# Altium project Gate_Level_Modeling.PrjPcb
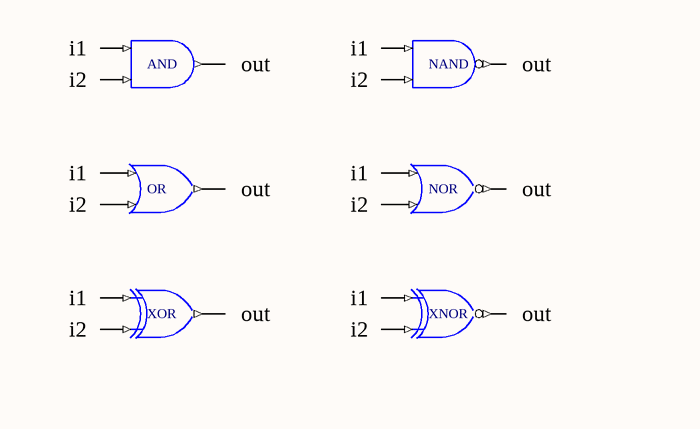
[diagram p0: 05_01_Basic_Gates.SchDoc]
8 sheets, 29 parts. Net scope: hierarchical (ports join the sheet entries above them; power ports are global).
Sheets:
  05_01_Basic_Gates.SchDoc
  05_02_Truth_Tables.SchDoc
  05_03_Buf_and_Not_Gates.SchDoc
  05_04_Bufif_and_Notif.SchDoc
  05_06_mux_gate.SchDoc
  05_05_mux_schem.SchDoc
  05_07_1bit_Full_Adder.SchDoc
  05_08_4bit_Ripple_Carry_Full_Adder.SchDoc

## Sheet 05_01_Basic_Gates.SchDoc
size 111 x 66 mm

### Parts
U9  AND
U10  NAND
U11  OR
U12  NOR
U13  XOR
U14  XNOR

### Nets
GND: U13.7(GND)
VDD: U13.14(VDD)

Not connected (* = marked no-connect by the designer): U9 A B Y; U10 A B Y; U11 A B Y; U12 A B Y; U13 1(A) 2(B) 3(Y); U14 1(A) 2(B) 3(Y)

### Notes on the sheet
- (near U9) i1
- (near U9) out
- (near U10) i1
- (near U10) out
- (near U9) i2
- (near U10) i2
- (near U11) i1
- (near U11) i2
- (near U11) out
- (near U12) i1
- (near U12) i2
- (near U12) out
- (near U13) i1
- (near U14) i1
- (near U13) i2
- (near U13) out
- (near U14) i2
- (near U14) out

### Library data of the parts
U9 U10 = AND: 2 Input AND
U11 U12 = OR: 2 Input OR
U14 = XOR

## Sheet 05_02_Truth_Tables.SchDoc
size 111 x 66 mm
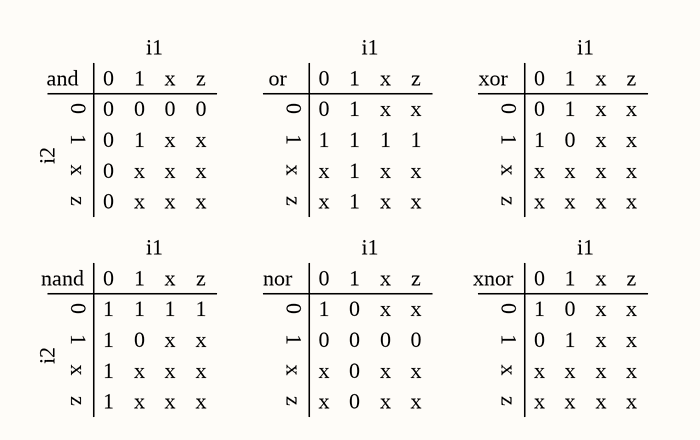
[diagram p1: 05_02_Truth_Tables.SchDoc]

### Notes on the sheet
- and
- 0
- 1
- i1
- x
- z
- or
- xor
- i2
- nand
- nor
- xnor

## Sheet 05_03_Buf_and_Not_Gates.SchDoc
size 111 x 66 mm
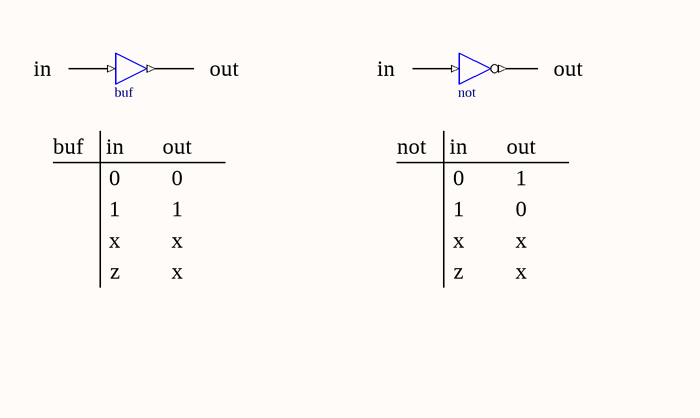
[diagram p2: 05_03_Buf_and_Not_Gates.SchDoc]

### Parts
U15  buf
U16  not

### Nets

Not connected (* = marked no-connect by the designer): U15 I O; U16 I O

### Notes on the sheet
- in
- out
- buf
- 0
- 1
- not
- x
- z

### Library data of the parts
U15 U16 = BUF: 1-bit General Purpose (Non-inverting) Buffer

## Sheet 05_04_Bufif_and_Notif.SchDoc
size 142 x 66 mm
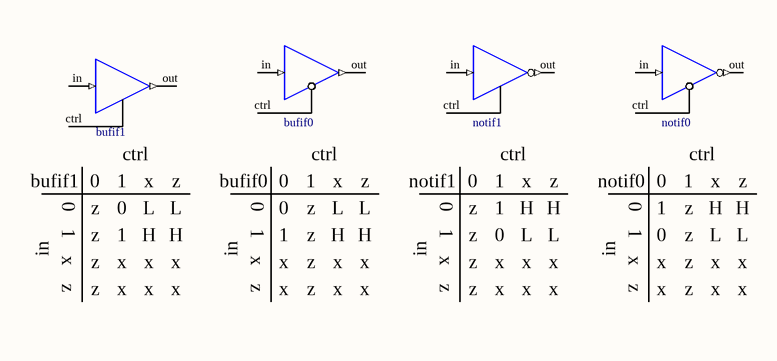
[diagram p3: 05_04_Bufif_and_Notif.SchDoc]

### Parts
U17  bufif0
U18  notif1
U19  notif0
U20  bufif1

### Nets

Not connected (* = marked no-connect by the designer): U17 ctrl in out; U18 ctrl in out; U19 ctrl in out; U20 ctrl in out

### Notes on the sheet
- (near U20) bufif1
- (near U20) 0
- (near U20) 1
- (near U20) ctrl
- (near U20) x
- (near U20) z
- bufif0
- 0
- 1
- (near U17) ctrl
- x
- z
- notif1
- (near U18) ctrl
- notif0
- (near U19) ctrl
- in
- L
- H

## Sheet 05_06_mux_gate.SchDoc
size 101 x 81 mm
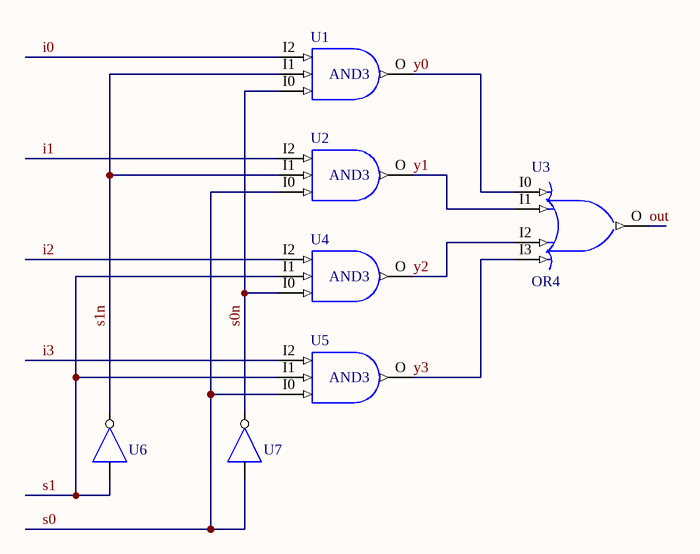
[diagram p4: 05_06_mux_gate.SchDoc]

### Parts
(Parts that share a designator on the sheet are numbered #1, #2 ... from top to bottom, then left to right.)
U1#1  AND3
U2#1  AND3
U3#1  OR4
U4#1  AND3
U5#1  AND3
U6  not  (value not drawn)
U7  not  (value not drawn)

### Nets
i0: U1#1.I2
i1: U2#1.I2
i2: U4#1.I2
i3: U5#1.I2
out: U3#1.O
s0: U2#1.I0 U5#1.I0 U7.i
s0n: U1#1.I0 U4#1.I0 U7.o
s1: U4#1.I1 U5#1.I1 U6.i
s1n: U1#1.I1 U2#1.I1 U6.o
y0: U1#1.O U3#1.I0
y1: U2#1.O U3#1.I1
y2: U3#1.I2 U4#1.O
y3: U3#1.I3 U5#1.O

### Library data of the parts
U1#1 U2#1 U4#1 U5#1 = AND3: 3-Input AND Gate; FPGAVendor: CUPL; Published: 17/04/2002 5:24:18 PM; DatasheetDocument: 1999; Publisher: Altium Limited
U3#1 = OR4: 4-Input OR Gate; FPGAVendor: CUPL; Published: 17-Apr-2002; Publisher: Altium Limited
U6 U7 = BUF: as U15 on sheet 05_03_Buf_and_Not_Gates

## Sheet 05_05_mux_schem.SchDoc
size 101 x 81 mm
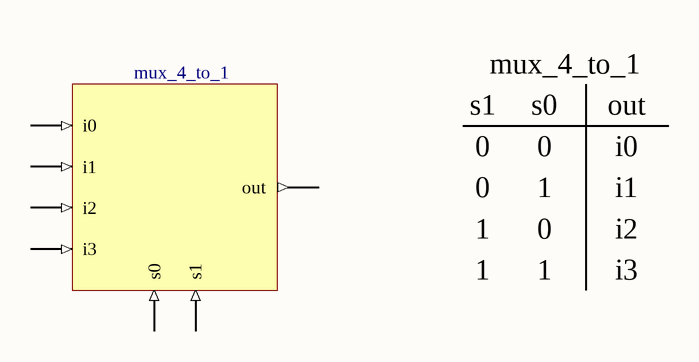
[diagram p5: 05_05_mux_schem.SchDoc]

### Parts
U8  mux_4_to_1

### Nets

Not connected (* = marked no-connect by the designer): U8 i0 i1 i2 i3 out s0 s1

### Notes on the sheet
- mux_4_to_1
- s1
- 0
- s0
- out
- i0
- 1
- i1
- i2
- i3

## Sheet 05_07_1bit_Full_Adder.SchDoc
size A4
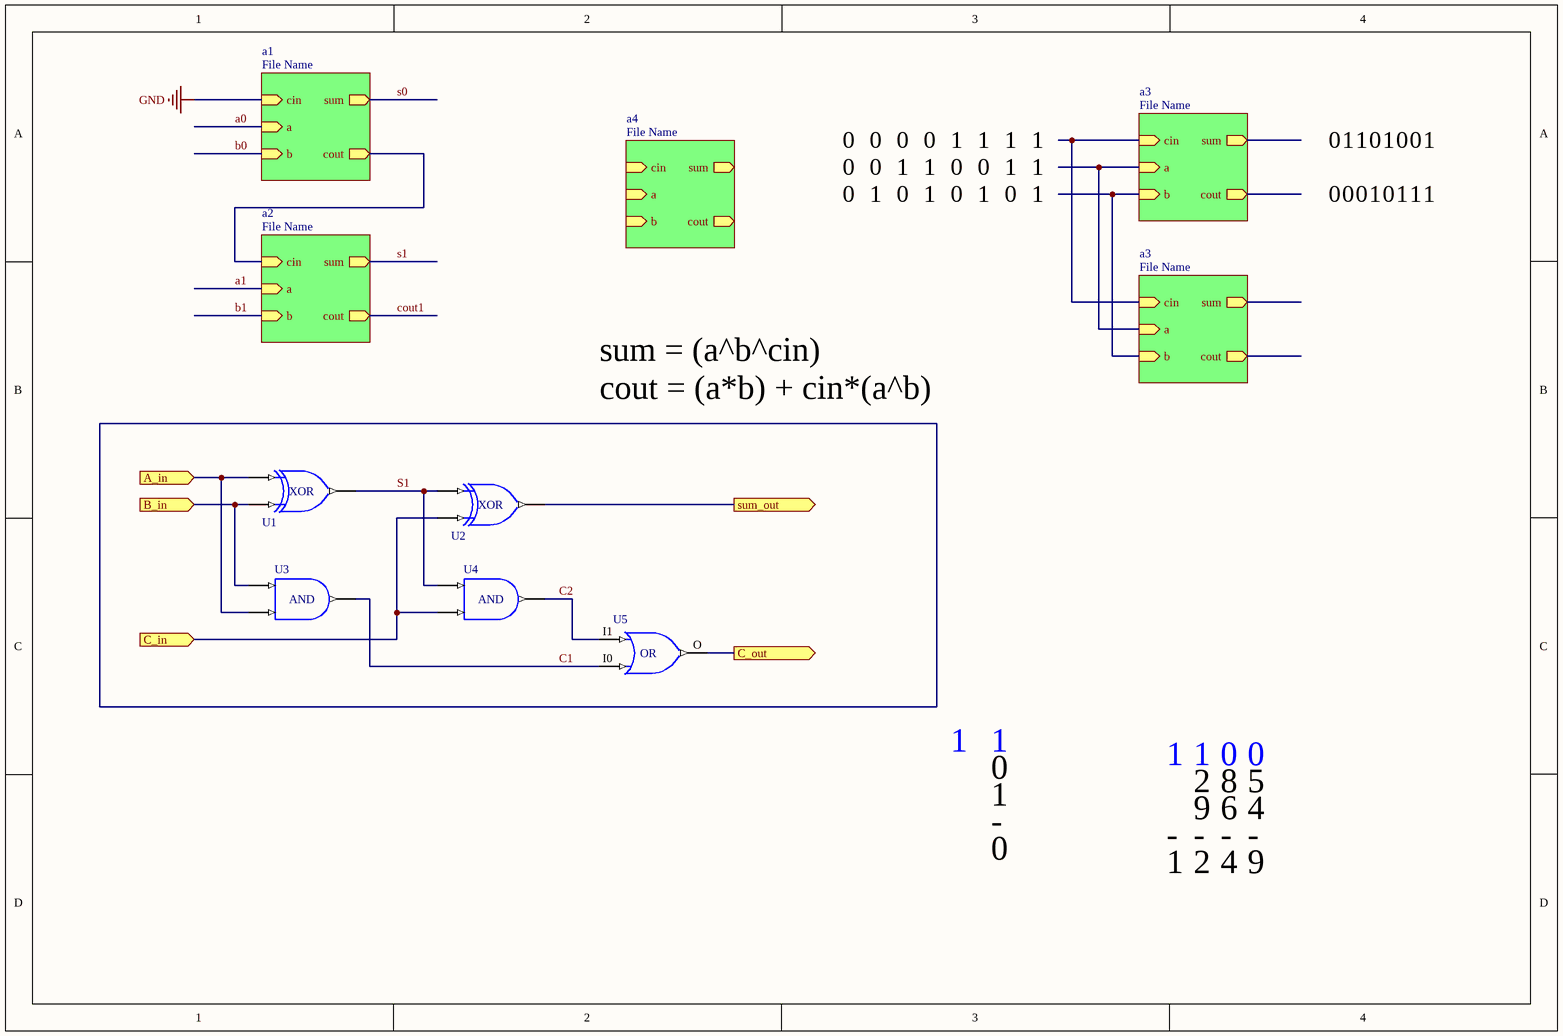
[diagram p6: 05_07_1bit_Full_Adder.SchDoc]

### Parts
(Parts that share a designator on the sheet are numbered #1, #2 ... from top to bottom, then left to right.)
U1#2  XOR
U2#2  XOR
U3#2  AND
U4#2  AND
U5#2  OR

### Sub-sheets
a1 = File Name (file not in this document): a (in), b (in), cin (in), sum (out), cout (out)
a2 = File Name (file not in this document): a (in), b (in), cin (in), sum (out), cout (out)
a3 = File Name (file not in this document): a (in), b (in), cin (in), sum (out), cout (out)
a3 = File Name (file not in this document): a (in), b (in), cin (in), sum (out), cout (out)
a4 = File Name (file not in this document): a (in), b (in), cin (in), sum (out), cout (out)

### Ports
A_in (in), B_in (in), C_in (in), C_out (out), sum_out (out)

### Nets
GND: U1#2.7(GND) U2#2.7(GND) ; sheet a1/cin
VDD: U1#2.14(VDD) U2#2.14(VDD)
a0: sheet a1/a
a1: sheet a2/a
b0: sheet a1/b
b1: sheet a2/b
C1: U3#2.Y U5#2.I0
C2: U4#2.Y U5#2.I1
cout1: sheet a2/cout
s0: sheet a1/sum
S1: U1#2.3(Y) U2#2.1(A) U4#2.A ; sheet a2/sum
NetU1#2_1: U1#2.1(A) U3#2.B ; port A_in
NetU1#2_2: U1#2.2(B) U3#2.A ; port B_in
NetU2#2_2: U2#2.2(B) U4#2.B ; port C_in
NetU2#2_3: U2#2.3(Y) ; port sum_out
NetU5#2_O: U5#2.O ; port C_out
(unnamed): sheet a1/cout, sheet a2/cin
(unnamed): sheet a3/a, sheet a3/a
(unnamed): sheet a3/b, sheet a3/b
(unnamed): sheet a3/cin, sheet a3/cin

### Notes on the sheet
- 0
- 1
- sum = (a^b^cin)
  cout = (a*b) + cin*(a^b)
- -
- 2
- 9
- 8
- 6
- 5
- 4

### Library data of the parts
U3#2 U4#2 = AND: 2 Input AND
U5#2 = OR2: 2-Input OR Gate; FPGAVendor: CUPL; Published: 17-Apr-2002; Publisher: Altium Limited

## Sheet 05_08_4bit_Ripple_Carry_Full_Adder.SchDoc
size 81 x 101 mm
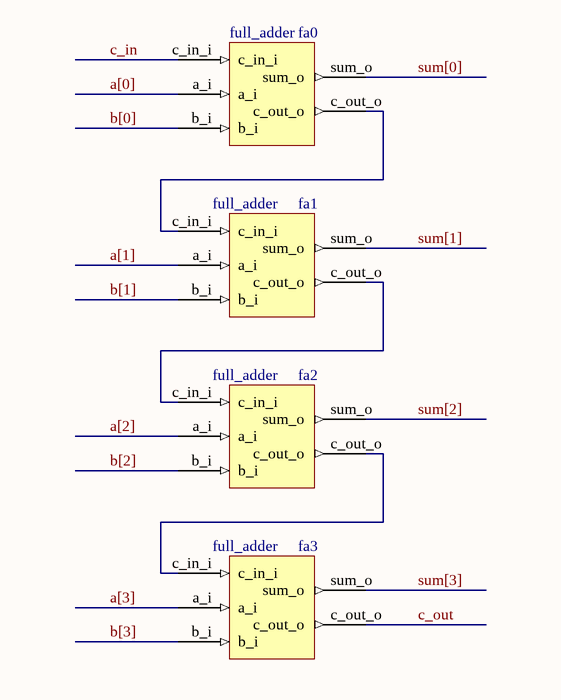
[diagram p7: 05_08_4bit_Ripple_Carry_Full_Adder.SchDoc]

### Parts
fa0  full_adder
fa1  full_adder
fa2  full_adder
fa3  full_adder

### Nets
a[0]: fa0.a_i
a[1]: fa1.a_i
a[2]: fa2.a_i
a[3]: fa3.a_i
b[0]: fa0.b_i
b[1]: fa1.b_i
b[2]: fa2.b_i
b[3]: fa3.b_i
c_in: fa0.c_in_i
c_out: fa3.c_out_o
sum[0]: fa0.sum_o
sum[1]: fa1.sum_o
sum[2]: fa2.sum_o
sum[3]: fa3.sum_o
Netfa0_c_out_o: fa0.c_out_o fa1.c_in_i
Netfa1_c_out_o: fa1.c_out_o fa2.c_in_i
Netfa2_c_out_o: fa2.c_out_o fa3.c_in_i

## Nets that join several sheets
GND: 05_01_Basic_Gates (U13.7), 05_07_1bit_Full_Adder (U1#2.7 U2#2.7)
VDD: 05_01_Basic_Gates (U13.14), 05_07_1bit_Full_Adder (U1#2.14 U2#2.14)